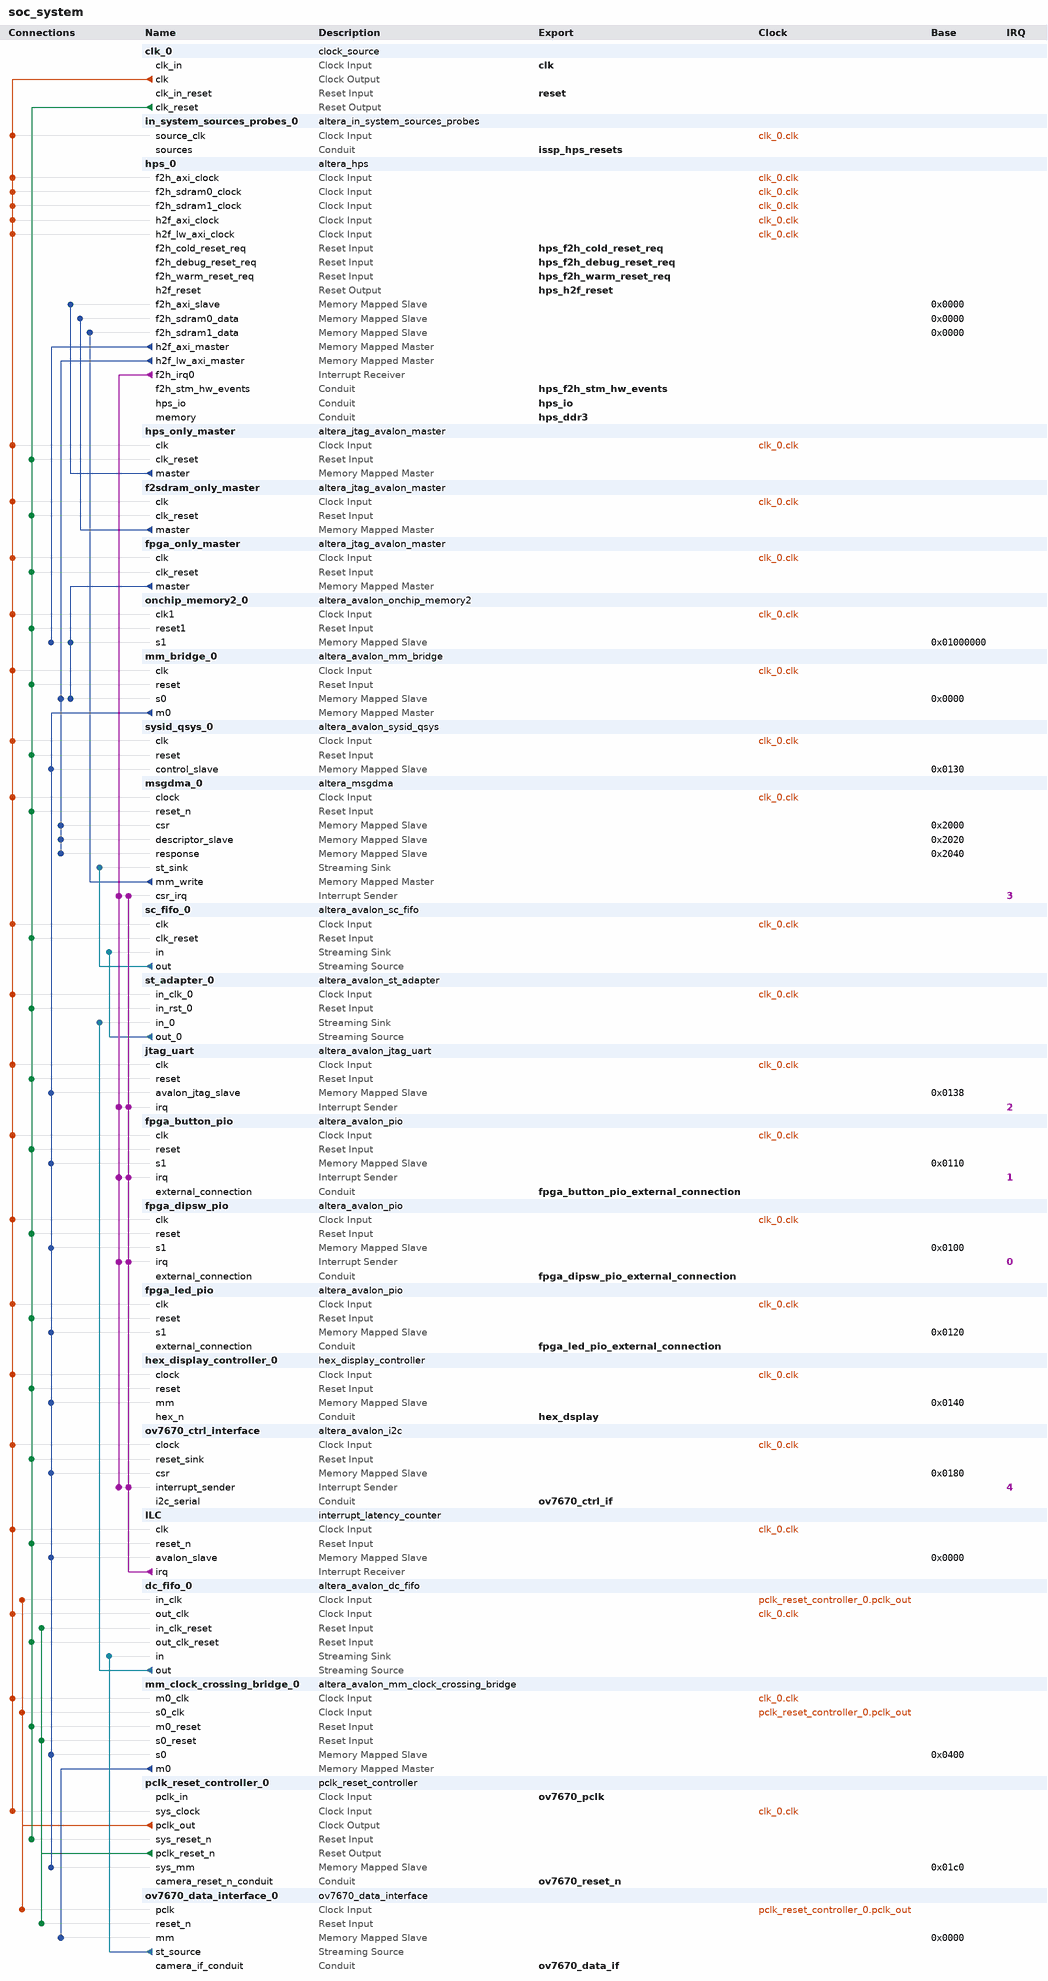
[diagram p0: system contents]
# Platform Designer (Qsys) system soc_system, Cyclone V 5CSEMA5F31C6
# Parameters at their usual value, and those the tool derives, are not listed.
package require -exact qsys 22.1
create_system soc_system
set_project_property DEVICE_FAMILY {Cyclone V}
set_project_property DEVICE 5CSEMA5F31C6

add_instance clk_0 clock_source 22.1
set_instance_parameter_value clk_0 clockFrequency 50000000

add_instance in_system_sources_probes_0 altera_in_system_sources_probes 22.1
set_instance_parameter_value in_system_sources_probes_0 create_source_clock true
set_instance_parameter_value in_system_sources_probes_0 instance_id RST
set_instance_parameter_value in_system_sources_probes_0 probe_width 0
set_instance_parameter_value in_system_sources_probes_0 source_width 3

add_instance hps_0 altera_hps 22.1
set_instance_parameter_value hps_0 EMAC1_Mode RGMII
set_instance_parameter_value hps_0 EMAC1_PinMuxing {HPS I/O Set 0}
set_instance_parameter_value hps_0 F2SCLK_COLDRST_Enable true
set_instance_parameter_value hps_0 F2SCLK_DBGRST_Enable true
set_instance_parameter_value hps_0 F2SCLK_WARMRST_Enable true
set_instance_parameter_value hps_0 F2SDRAM_Type {Avalon-MM Bidirectional,Avalon-MM Write-Only}
set_instance_parameter_value hps_0 F2SDRAM_Width 128,128
set_instance_parameter_value hps_0 F2SINTERRUPT_Enable true
set_instance_parameter_value hps_0 F2S_Width 2
set_instance_parameter_value hps_0 FPGA_PERIPHERAL_OUTPUT_CLOCK_FREQ_EMAC0_GTX_CLK 125
set_instance_parameter_value hps_0 FPGA_PERIPHERAL_OUTPUT_CLOCK_FREQ_EMAC0_MD_CLK 2.5
set_instance_parameter_value hps_0 FPGA_PERIPHERAL_OUTPUT_CLOCK_FREQ_EMAC1_GTX_CLK 125
set_instance_parameter_value hps_0 FPGA_PERIPHERAL_OUTPUT_CLOCK_FREQ_EMAC1_MD_CLK 2.5
set_instance_parameter_value hps_0 HPS_PROTOCOL DDR3
set_instance_parameter_value hps_0 I2C0_Mode I2C
set_instance_parameter_value hps_0 I2C0_PinMuxing {HPS I/O Set 0}
set_instance_parameter_value hps_0 I2C1_Mode I2C
set_instance_parameter_value hps_0 I2C1_PinMuxing {HPS I/O Set 0}
set_instance_parameter_value hps_0 LWH2F_Enable true
set_instance_parameter_value hps_0 MEM_BANKADDR_WIDTH 3
set_instance_parameter_value hps_0 MEM_CLK_FREQ 400.0
set_instance_parameter_value hps_0 MEM_COL_ADDR_WIDTH 10
set_instance_parameter_value hps_0 MEM_DQ_WIDTH 32
set_instance_parameter_value hps_0 MEM_DRV_STR RZQ/6
set_instance_parameter_value hps_0 MEM_ROW_ADDR_WIDTH 15
set_instance_parameter_value hps_0 MEM_RTT_NOM RZQ/6
set_instance_parameter_value hps_0 MEM_RTT_WR {Dynamic ODT off}
set_instance_parameter_value hps_0 MEM_TCL 7
set_instance_parameter_value hps_0 MEM_TFAW_NS 45.0
set_instance_parameter_value hps_0 MEM_TRAS_NS 36.0
set_instance_parameter_value hps_0 MEM_TRCD_NS 13.125
set_instance_parameter_value hps_0 MEM_TRFC_NS 300.0
set_instance_parameter_value hps_0 MEM_TRP_NS 13.125
set_instance_parameter_value hps_0 MEM_VENDOR Micron
set_instance_parameter_value hps_0 MEM_WTCL 7
set_instance_parameter_value hps_0 QSPI_Mode {1 SS}
set_instance_parameter_value hps_0 QSPI_PinMuxing {HPS I/O Set 0}
set_instance_parameter_value hps_0 REF_CLK_FREQ 25.0
set_instance_parameter_value hps_0 S2FCLK_USER2CLK 5
set_instance_parameter_value hps_0 S2F_Width 2
set_instance_parameter_value hps_0 SDIO_Mode {4-bit Data}
set_instance_parameter_value hps_0 SDIO_PinMuxing {HPS I/O Set 0}
set_instance_parameter_value hps_0 SPIM1_Mode {Single Slave Select}
set_instance_parameter_value hps_0 SPIM1_PinMuxing {HPS I/O Set 0}
set_instance_parameter_value hps_0 STM_Enable true
set_instance_parameter_value hps_0 TIMING_BOARD_AC_SKEW 0.02
set_instance_parameter_value hps_0 TIMING_BOARD_AC_TO_CK_SKEW 0.01
set_instance_parameter_value hps_0 TIMING_BOARD_DQ_TO_DQS_SKEW 0.05
set_instance_parameter_value hps_0 TIMING_BOARD_MAX_CK_DELAY 0.03
set_instance_parameter_value hps_0 TIMING_BOARD_MAX_DQS_DELAY 0.02
set_instance_parameter_value hps_0 TIMING_BOARD_SKEW_BETWEEN_DQS 0.06
set_instance_parameter_value hps_0 TIMING_BOARD_SKEW_CKDQS_DIMM_MAX 0.12
set_instance_parameter_value hps_0 TIMING_BOARD_SKEW_CKDQS_DIMM_MIN 0.06
set_instance_parameter_value hps_0 TIMING_BOARD_SKEW_WITHIN_DQS 0.1
set_instance_parameter_value hps_0 TIMING_TDH 65
set_instance_parameter_value hps_0 TIMING_TDQSCK 255
set_instance_parameter_value hps_0 TIMING_TDQSQ 125
set_instance_parameter_value hps_0 TIMING_TDS 30
set_instance_parameter_value hps_0 TIMING_TIH 140
set_instance_parameter_value hps_0 TIMING_TIS 190
set_instance_parameter_value hps_0 TIMING_TQSH 0.4
set_instance_parameter_value hps_0 UART0_Mode {No Flow Control}
set_instance_parameter_value hps_0 UART0_PinMuxing {HPS I/O Set 0}
set_instance_parameter_value hps_0 USB1_Mode SDR
set_instance_parameter_value hps_0 USB1_PinMuxing {HPS I/O Set 0}
set_instance_parameter_value hps_0 desired_cfg_clk_mhz 100.0
set_instance_parameter_value hps_0 desired_qspi_clk_mhz 400.0
set_instance_parameter_value hps_0 use_default_mpu_clk false

add_instance hps_only_master altera_jtag_avalon_master 22.1

add_instance f2sdram_only_master altera_jtag_avalon_master 22.1

add_instance fpga_only_master altera_jtag_avalon_master 22.1

add_instance onchip_memory2_0 altera_avalon_onchip_memory2 22.1
set_instance_parameter_value onchip_memory2_0 dataWidth 32
set_instance_parameter_value onchip_memory2_0 dualPort false
set_instance_parameter_value onchip_memory2_0 initMemContent true
set_instance_parameter_value onchip_memory2_0 initializationFileName onchip_mem.hex
set_instance_parameter_value onchip_memory2_0 memorySize 65536

add_instance mm_bridge_0 altera_avalon_mm_bridge 22.1
set_instance_parameter_value mm_bridge_0 ADDRESS_UNITS SYMBOLS
set_instance_parameter_value mm_bridge_0 ADDRESS_WIDTH 10
set_instance_parameter_value mm_bridge_0 DATA_WIDTH 32
set_instance_parameter_value mm_bridge_0 MAX_PENDING_RESPONSES 4
set_instance_parameter_value mm_bridge_0 USE_AUTO_ADDRESS_WIDTH 1

add_instance sysid_qsys_0 altera_avalon_sysid_qsys 22.1
set_instance_parameter_value sysid_qsys_0 id -1395321600

add_instance msgdma_0 altera_msgdma 22.1
set_instance_parameter_value msgdma_0 BURST_ENABLE 1
set_instance_parameter_value msgdma_0 DATA_FIFO_DEPTH 4096
set_instance_parameter_value msgdma_0 DATA_WIDTH 128
set_instance_parameter_value msgdma_0 DESCRIPTOR_FIFO_DEPTH 256
set_instance_parameter_value msgdma_0 ENHANCED_FEATURES 1
set_instance_parameter_value msgdma_0 ERROR_ENABLE 0
set_instance_parameter_value msgdma_0 MAX_BURST_COUNT 512
set_instance_parameter_value msgdma_0 MAX_BYTE 4194304
set_instance_parameter_value msgdma_0 MODE 2
set_instance_parameter_value msgdma_0 PACKET_ENABLE 1
set_instance_parameter_value msgdma_0 RESPONSE_PORT 0
set_instance_parameter_value msgdma_0 TRANSFER_TYPE {Aligned Accesses}

add_instance sc_fifo_0 altera_avalon_sc_fifo 22.1
set_instance_parameter_value sc_fifo_0 BITS_PER_SYMBOL 8
set_instance_parameter_value sc_fifo_0 CHANNEL_WIDTH 0
set_instance_parameter_value sc_fifo_0 ERROR_WIDTH 0
set_instance_parameter_value sc_fifo_0 FIFO_DEPTH 8192
set_instance_parameter_value sc_fifo_0 SYMBOLS_PER_BEAT 16
set_instance_parameter_value sc_fifo_0 USE_FILL_LEVEL 0
set_instance_parameter_value sc_fifo_0 USE_MEMORY_BLOCKS 1
set_instance_parameter_value sc_fifo_0 USE_PACKETS 1
set_instance_parameter_value sc_fifo_0 USE_STORE_FORWARD 0

add_instance st_adapter_0 altera_avalon_st_adapter 22.1
set_instance_parameter_value st_adapter_0 inBitsPerSymbol 8
set_instance_parameter_value st_adapter_0 inChannelWidth 0
set_instance_parameter_value st_adapter_0 inDataWidth 8
set_instance_parameter_value st_adapter_0 inErrorWidth 0
set_instance_parameter_value st_adapter_0 inMaxChannel 0
set_instance_parameter_value st_adapter_0 inReadyLatency 0
set_instance_parameter_value st_adapter_0 inUseEmptyPort 0
set_instance_parameter_value st_adapter_0 inUsePackets 1
set_instance_parameter_value st_adapter_0 inUseReady 1
set_instance_parameter_value st_adapter_0 inUseValid 1
set_instance_parameter_value st_adapter_0 outChannelWidth 0
set_instance_parameter_value st_adapter_0 outDataWidth 128
set_instance_parameter_value st_adapter_0 outErrorWidth 0
set_instance_parameter_value st_adapter_0 outMaxChannel 0
set_instance_parameter_value st_adapter_0 outReadyLatency 0
set_instance_parameter_value st_adapter_0 outUseEmptyPort 1
set_instance_parameter_value st_adapter_0 outUseReady 1
set_instance_parameter_value st_adapter_0 outUseValid 1

add_instance jtag_uart altera_avalon_jtag_uart 22.1
set_instance_parameter_value jtag_uart simInteractiveOptions NO_INTERACTIVE_WINDOWS

add_instance fpga_button_pio altera_avalon_pio 22.1
set_instance_parameter_value fpga_button_pio bitClearingEdgeCapReg true
set_instance_parameter_value fpga_button_pio captureEdge true
set_instance_parameter_value fpga_button_pio direction Input
set_instance_parameter_value fpga_button_pio edgeType FALLING
set_instance_parameter_value fpga_button_pio generateIRQ true
set_instance_parameter_value fpga_button_pio irqType EDGE
set_instance_parameter_value fpga_button_pio width 4

add_instance fpga_dipsw_pio altera_avalon_pio 22.1
set_instance_parameter_value fpga_dipsw_pio bitClearingEdgeCapReg true
set_instance_parameter_value fpga_dipsw_pio captureEdge true
set_instance_parameter_value fpga_dipsw_pio direction Input
set_instance_parameter_value fpga_dipsw_pio edgeType ANY
set_instance_parameter_value fpga_dipsw_pio generateIRQ true
set_instance_parameter_value fpga_dipsw_pio irqType EDGE
set_instance_parameter_value fpga_dipsw_pio width 10

add_instance fpga_led_pio altera_avalon_pio 22.1
set_instance_parameter_value fpga_led_pio direction Output
set_instance_parameter_value fpga_led_pio width 10

add_instance hex_display_controller_0 hex_display_controller 1.0

add_instance ov7670_ctrl_interface altera_avalon_i2c 22.1
set_instance_parameter_value ov7670_ctrl_interface FIFO_DEPTH 4

add_instance ILC interrupt_latency_counter 22.1
set_instance_parameter_value ILC IRQ_PORT_CNT 8

add_instance dc_fifo_0 altera_avalon_dc_fifo 22.1
set_instance_parameter_value dc_fifo_0 BITS_PER_SYMBOL 8
set_instance_parameter_value dc_fifo_0 FIFO_DEPTH 65536
set_instance_parameter_value dc_fifo_0 USE_PACKETS 1

add_instance mm_clock_crossing_bridge_0 altera_avalon_mm_clock_crossing_bridge 22.1
set_instance_parameter_value mm_clock_crossing_bridge_0 ADDRESS_WIDTH 10
set_instance_parameter_value mm_clock_crossing_bridge_0 COMMAND_FIFO_DEPTH 4
set_instance_parameter_value mm_clock_crossing_bridge_0 DATA_WIDTH 32
set_instance_parameter_value mm_clock_crossing_bridge_0 MASTER_SYNC_DEPTH 2
set_instance_parameter_value mm_clock_crossing_bridge_0 MAX_BURST_SIZE 1
set_instance_parameter_value mm_clock_crossing_bridge_0 RESPONSE_FIFO_DEPTH 4
set_instance_parameter_value mm_clock_crossing_bridge_0 SLAVE_SYNC_DEPTH 2
set_instance_parameter_value mm_clock_crossing_bridge_0 USE_AUTO_ADDRESS_WIDTH 0

add_instance pclk_reset_controller_0 pclk_reset_controller 1.4

add_instance ov7670_data_interface_0 ov7670_data_interface 1.2
set_instance_parameter_value ov7670_data_interface_0 FRAME_SIZE 307200

# connections
add_connection clk_0.clk dc_fifo_0.out_clk clock
add_connection clk_0.clk f2sdram_only_master.clk clock
add_connection clk_0.clk fpga_button_pio.clk clock
add_connection clk_0.clk fpga_dipsw_pio.clk clock
add_connection clk_0.clk fpga_led_pio.clk clock
add_connection clk_0.clk fpga_only_master.clk clock
add_connection clk_0.clk hex_display_controller_0.clock clock
add_connection clk_0.clk hps_0.f2h_axi_clock clock
add_connection clk_0.clk hps_0.f2h_sdram0_clock clock
add_connection clk_0.clk hps_0.f2h_sdram1_clock clock
add_connection clk_0.clk hps_0.h2f_axi_clock clock
add_connection clk_0.clk hps_0.h2f_lw_axi_clock clock
add_connection clk_0.clk hps_only_master.clk clock
add_connection clk_0.clk ILC.clk clock
add_connection clk_0.clk in_system_sources_probes_0.source_clk clock
add_connection clk_0.clk jtag_uart.clk clock
add_connection clk_0.clk mm_bridge_0.clk clock
add_connection clk_0.clk mm_clock_crossing_bridge_0.m0_clk clock
add_connection clk_0.clk msgdma_0.clock clock
add_connection clk_0.clk onchip_memory2_0.clk1 clock
add_connection clk_0.clk ov7670_ctrl_interface.clock clock
add_connection clk_0.clk pclk_reset_controller_0.sys_clock clock
add_connection clk_0.clk sc_fifo_0.clk clock
add_connection clk_0.clk st_adapter_0.in_clk_0 clock
add_connection clk_0.clk sysid_qsys_0.clk clock
add_connection pclk_reset_controller_0.pclk_out dc_fifo_0.in_clk clock
add_connection pclk_reset_controller_0.pclk_out mm_clock_crossing_bridge_0.s0_clk clock
add_connection pclk_reset_controller_0.pclk_out ov7670_data_interface_0.pclk clock
add_connection clk_0.clk_reset dc_fifo_0.out_clk_reset reset
add_connection clk_0.clk_reset f2sdram_only_master.clk_reset reset
add_connection clk_0.clk_reset fpga_button_pio.reset reset
add_connection clk_0.clk_reset fpga_dipsw_pio.reset reset
add_connection clk_0.clk_reset fpga_led_pio.reset reset
add_connection clk_0.clk_reset fpga_only_master.clk_reset reset
add_connection clk_0.clk_reset hex_display_controller_0.reset reset
add_connection clk_0.clk_reset hps_only_master.clk_reset reset
add_connection clk_0.clk_reset ILC.reset_n reset
add_connection clk_0.clk_reset jtag_uart.reset reset
add_connection clk_0.clk_reset mm_bridge_0.reset reset
add_connection clk_0.clk_reset mm_clock_crossing_bridge_0.m0_reset reset
add_connection clk_0.clk_reset msgdma_0.reset_n reset
add_connection clk_0.clk_reset onchip_memory2_0.reset1 reset
add_connection clk_0.clk_reset ov7670_ctrl_interface.reset_sink reset
add_connection clk_0.clk_reset pclk_reset_controller_0.sys_reset_n reset
add_connection clk_0.clk_reset sc_fifo_0.clk_reset reset
add_connection clk_0.clk_reset st_adapter_0.in_rst_0 reset
add_connection clk_0.clk_reset sysid_qsys_0.reset reset
add_connection pclk_reset_controller_0.pclk_reset_n dc_fifo_0.in_clk_reset reset
add_connection pclk_reset_controller_0.pclk_reset_n mm_clock_crossing_bridge_0.s0_reset reset
add_connection pclk_reset_controller_0.pclk_reset_n ov7670_data_interface_0.reset_n reset
add_connection f2sdram_only_master.master hps_0.f2h_sdram0_data avalon
set_connection_parameter_value f2sdram_only_master.master/hps_0.f2h_sdram0_data baseAddress 0x0000
add_connection fpga_only_master.master mm_bridge_0.s0 avalon
set_connection_parameter_value fpga_only_master.master/mm_bridge_0.s0 baseAddress 0x0000
add_connection fpga_only_master.master onchip_memory2_0.s1 avalon
set_connection_parameter_value fpga_only_master.master/onchip_memory2_0.s1 baseAddress 0x01000000
add_connection hps_0.h2f_axi_master onchip_memory2_0.s1 avalon
set_connection_parameter_value hps_0.h2f_axi_master/onchip_memory2_0.s1 baseAddress 0x01000000
add_connection hps_0.h2f_lw_axi_master mm_bridge_0.s0 avalon
set_connection_parameter_value hps_0.h2f_lw_axi_master/mm_bridge_0.s0 baseAddress 0x0000
add_connection hps_0.h2f_lw_axi_master msgdma_0.csr avalon
set_connection_parameter_value hps_0.h2f_lw_axi_master/msgdma_0.csr baseAddress 0x2000
add_connection hps_0.h2f_lw_axi_master msgdma_0.descriptor_slave avalon
set_connection_parameter_value hps_0.h2f_lw_axi_master/msgdma_0.descriptor_slave baseAddress 0x2020
add_connection hps_0.h2f_lw_axi_master msgdma_0.response avalon
set_connection_parameter_value hps_0.h2f_lw_axi_master/msgdma_0.response baseAddress 0x2040
add_connection hps_only_master.master hps_0.f2h_axi_slave avalon
set_connection_parameter_value hps_only_master.master/hps_0.f2h_axi_slave baseAddress 0x0000
add_connection mm_bridge_0.m0 fpga_button_pio.s1 avalon
set_connection_parameter_value mm_bridge_0.m0/fpga_button_pio.s1 baseAddress 0x0110
add_connection mm_bridge_0.m0 fpga_dipsw_pio.s1 avalon
set_connection_parameter_value mm_bridge_0.m0/fpga_dipsw_pio.s1 baseAddress 0x0100
add_connection mm_bridge_0.m0 fpga_led_pio.s1 avalon
set_connection_parameter_value mm_bridge_0.m0/fpga_led_pio.s1 baseAddress 0x0120
add_connection mm_bridge_0.m0 hex_display_controller_0.mm avalon
set_connection_parameter_value mm_bridge_0.m0/hex_display_controller_0.mm baseAddress 0x0140
add_connection mm_bridge_0.m0 ILC.avalon_slave avalon
set_connection_parameter_value mm_bridge_0.m0/ILC.avalon_slave baseAddress 0x0000
add_connection mm_bridge_0.m0 jtag_uart.avalon_jtag_slave avalon
set_connection_parameter_value mm_bridge_0.m0/jtag_uart.avalon_jtag_slave baseAddress 0x0138
add_connection mm_bridge_0.m0 mm_clock_crossing_bridge_0.s0 avalon
set_connection_parameter_value mm_bridge_0.m0/mm_clock_crossing_bridge_0.s0 baseAddress 0x0400
add_connection mm_bridge_0.m0 ov7670_ctrl_interface.csr avalon
set_connection_parameter_value mm_bridge_0.m0/ov7670_ctrl_interface.csr baseAddress 0x0180
add_connection mm_bridge_0.m0 pclk_reset_controller_0.sys_mm avalon
set_connection_parameter_value mm_bridge_0.m0/pclk_reset_controller_0.sys_mm baseAddress 0x01c0
add_connection mm_bridge_0.m0 sysid_qsys_0.control_slave avalon
set_connection_parameter_value mm_bridge_0.m0/sysid_qsys_0.control_slave baseAddress 0x0130
add_connection mm_clock_crossing_bridge_0.m0 ov7670_data_interface_0.mm avalon
set_connection_parameter_value mm_clock_crossing_bridge_0.m0/ov7670_data_interface_0.mm baseAddress 0x0000
add_connection msgdma_0.mm_write hps_0.f2h_sdram1_data avalon
set_connection_parameter_value msgdma_0.mm_write/hps_0.f2h_sdram1_data baseAddress 0x0000
add_connection dc_fifo_0.out st_adapter_0.in_0 avalon_streaming
add_connection ov7670_data_interface_0.st_source dc_fifo_0.in avalon_streaming
add_connection sc_fifo_0.out msgdma_0.st_sink avalon_streaming
add_connection st_adapter_0.out_0 sc_fifo_0.in avalon_streaming
add_connection hps_0.f2h_irq0 fpga_button_pio.irq interrupt
set_connection_parameter_value hps_0.f2h_irq0/fpga_button_pio.irq irqNumber 1
add_connection hps_0.f2h_irq0 fpga_dipsw_pio.irq interrupt
set_connection_parameter_value hps_0.f2h_irq0/fpga_dipsw_pio.irq irqNumber 0
add_connection hps_0.f2h_irq0 jtag_uart.irq interrupt
set_connection_parameter_value hps_0.f2h_irq0/jtag_uart.irq irqNumber 2
add_connection hps_0.f2h_irq0 msgdma_0.csr_irq interrupt
set_connection_parameter_value hps_0.f2h_irq0/msgdma_0.csr_irq irqNumber 3
add_connection hps_0.f2h_irq0 ov7670_ctrl_interface.interrupt_sender interrupt
set_connection_parameter_value hps_0.f2h_irq0/ov7670_ctrl_interface.interrupt_sender irqNumber 4
add_connection ILC.irq fpga_button_pio.irq interrupt
set_connection_parameter_value ILC.irq/fpga_button_pio.irq irqNumber 1
add_connection ILC.irq fpga_dipsw_pio.irq interrupt
set_connection_parameter_value ILC.irq/fpga_dipsw_pio.irq irqNumber 0
add_connection ILC.irq jtag_uart.irq interrupt
set_connection_parameter_value ILC.irq/jtag_uart.irq irqNumber 2
add_connection ILC.irq msgdma_0.csr_irq interrupt
set_connection_parameter_value ILC.irq/msgdma_0.csr_irq irqNumber 3
add_connection ILC.irq ov7670_ctrl_interface.interrupt_sender interrupt
set_connection_parameter_value ILC.irq/ov7670_ctrl_interface.interrupt_sender irqNumber 4

# exported interfaces
add_interface clk clock sink
set_interface_property clk EXPORT_OF clk_0.clk_in
add_interface fpga_button_pio_external_connection conduit end
set_interface_property fpga_button_pio_external_connection EXPORT_OF fpga_button_pio.external_connection
add_interface fpga_dipsw_pio_external_connection conduit end
set_interface_property fpga_dipsw_pio_external_connection EXPORT_OF fpga_dipsw_pio.external_connection
add_interface fpga_led_pio_external_connection conduit end
set_interface_property fpga_led_pio_external_connection EXPORT_OF fpga_led_pio.external_connection
add_interface hex_dsplay conduit end
set_interface_property hex_dsplay EXPORT_OF hex_display_controller_0.hex_n
add_interface hps_ddr3 conduit end
set_interface_property hps_ddr3 EXPORT_OF hps_0.memory
add_interface hps_f2h_cold_reset_req reset sink
set_interface_property hps_f2h_cold_reset_req EXPORT_OF hps_0.f2h_cold_reset_req
add_interface hps_f2h_debug_reset_req reset sink
set_interface_property hps_f2h_debug_reset_req EXPORT_OF hps_0.f2h_debug_reset_req
add_interface hps_f2h_stm_hw_events conduit end
set_interface_property hps_f2h_stm_hw_events EXPORT_OF hps_0.f2h_stm_hw_events
add_interface hps_f2h_warm_reset_req reset sink
set_interface_property hps_f2h_warm_reset_req EXPORT_OF hps_0.f2h_warm_reset_req
add_interface hps_h2f_reset reset source
set_interface_property hps_h2f_reset EXPORT_OF hps_0.h2f_reset
add_interface hps_io conduit end
set_interface_property hps_io EXPORT_OF hps_0.hps_io
add_interface issp_hps_resets conduit end
set_interface_property issp_hps_resets EXPORT_OF in_system_sources_probes_0.sources
add_interface ov7670_ctrl_if conduit end
set_interface_property ov7670_ctrl_if EXPORT_OF ov7670_ctrl_interface.i2c_serial
add_interface ov7670_data_if conduit end
set_interface_property ov7670_data_if EXPORT_OF ov7670_data_interface_0.camera_if_conduit
add_interface ov7670_pclk clock sink
set_interface_property ov7670_pclk EXPORT_OF pclk_reset_controller_0.pclk_in
add_interface ov7670_reset_n conduit end
set_interface_property ov7670_reset_n EXPORT_OF pclk_reset_controller_0.camera_reset_n_conduit
add_interface reset reset sink
set_interface_property reset EXPORT_OF clk_0.clk_in_reset

set_interconnect_requirement {$system} qsys_mm.clockCrossingAdapter HANDSHAKE
set_interconnect_requirement {$system} qsys_mm.enableEccProtection FALSE
set_interconnect_requirement {$system} qsys_mm.insertDefaultSlave FALSE
set_interconnect_requirement {$system} qsys_mm.maxAdditionalLatency 1

save_system soc_system.qsys
